# Altium schematic sheet nexus5.SchDoc
size A0
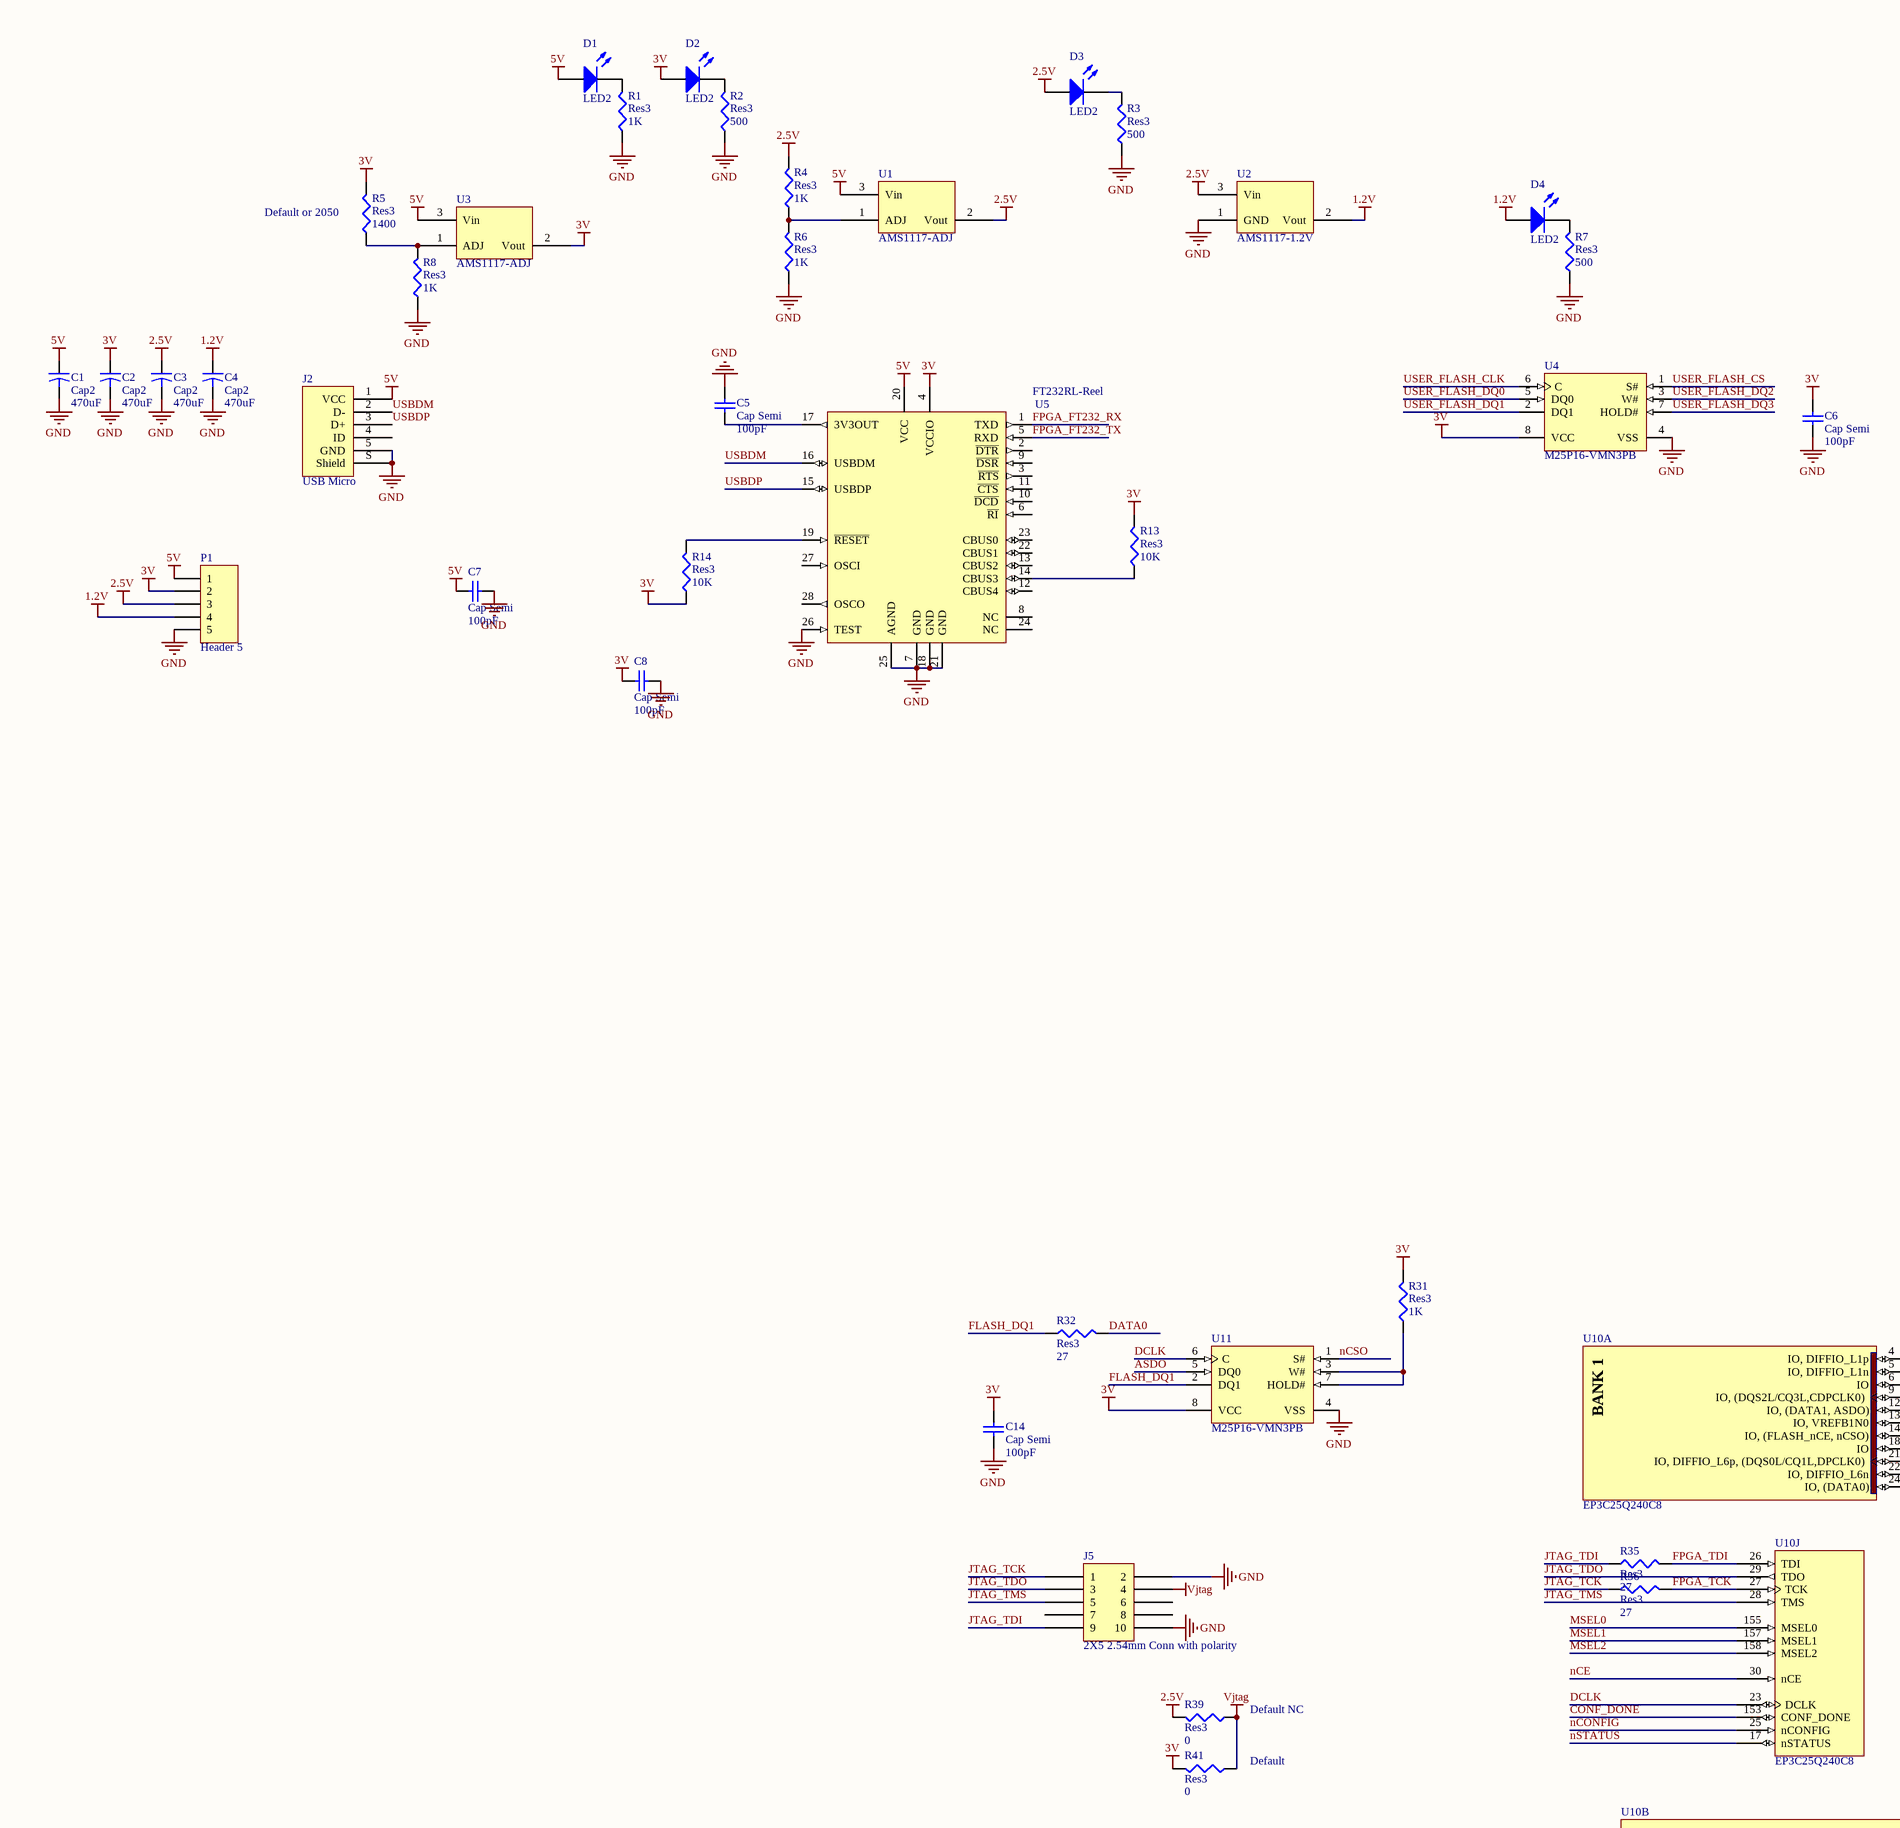
[diagram p0: nexus5.SchDoc, top left]
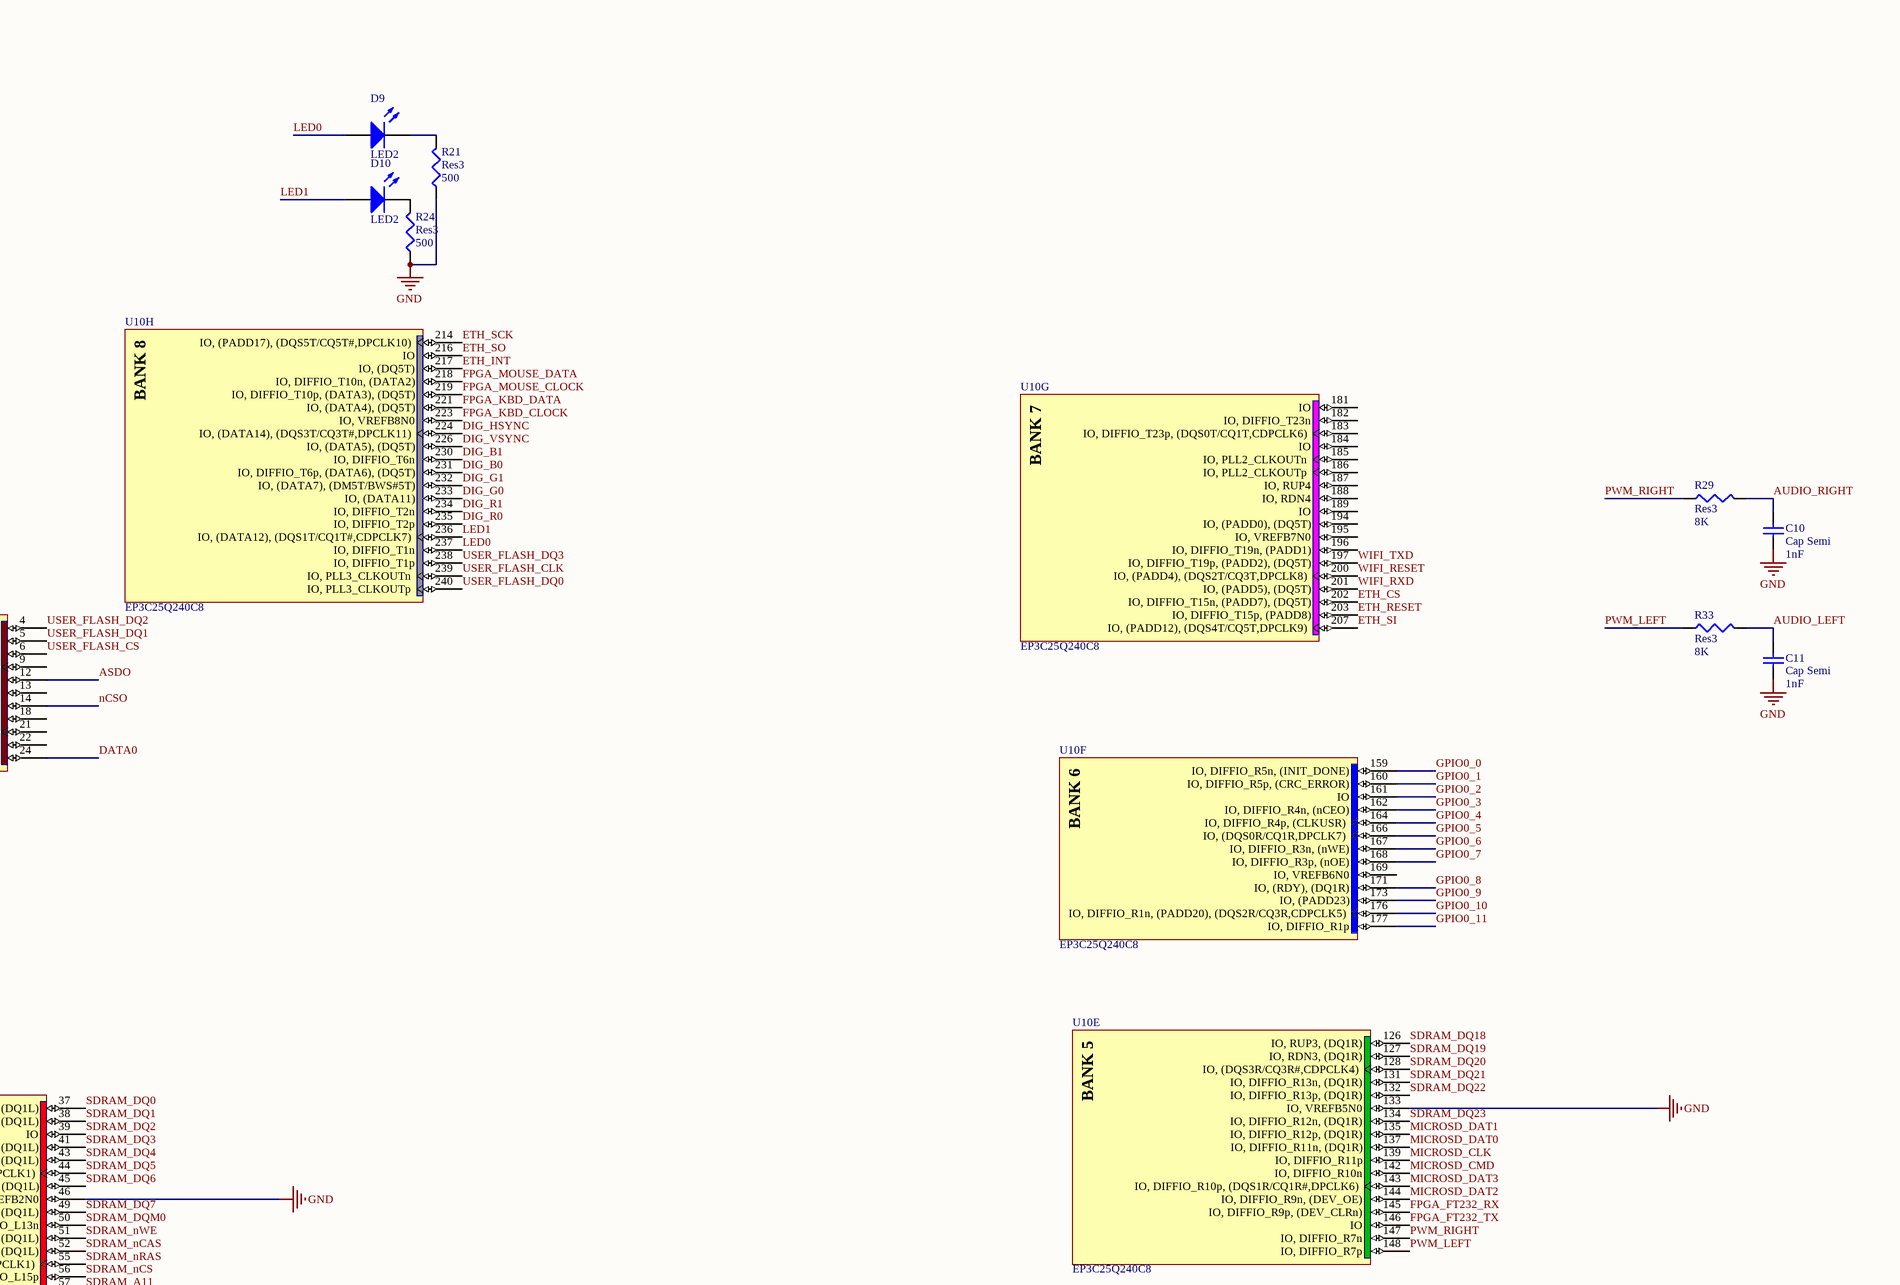
[diagram p1: nexus5.SchDoc, top middle]
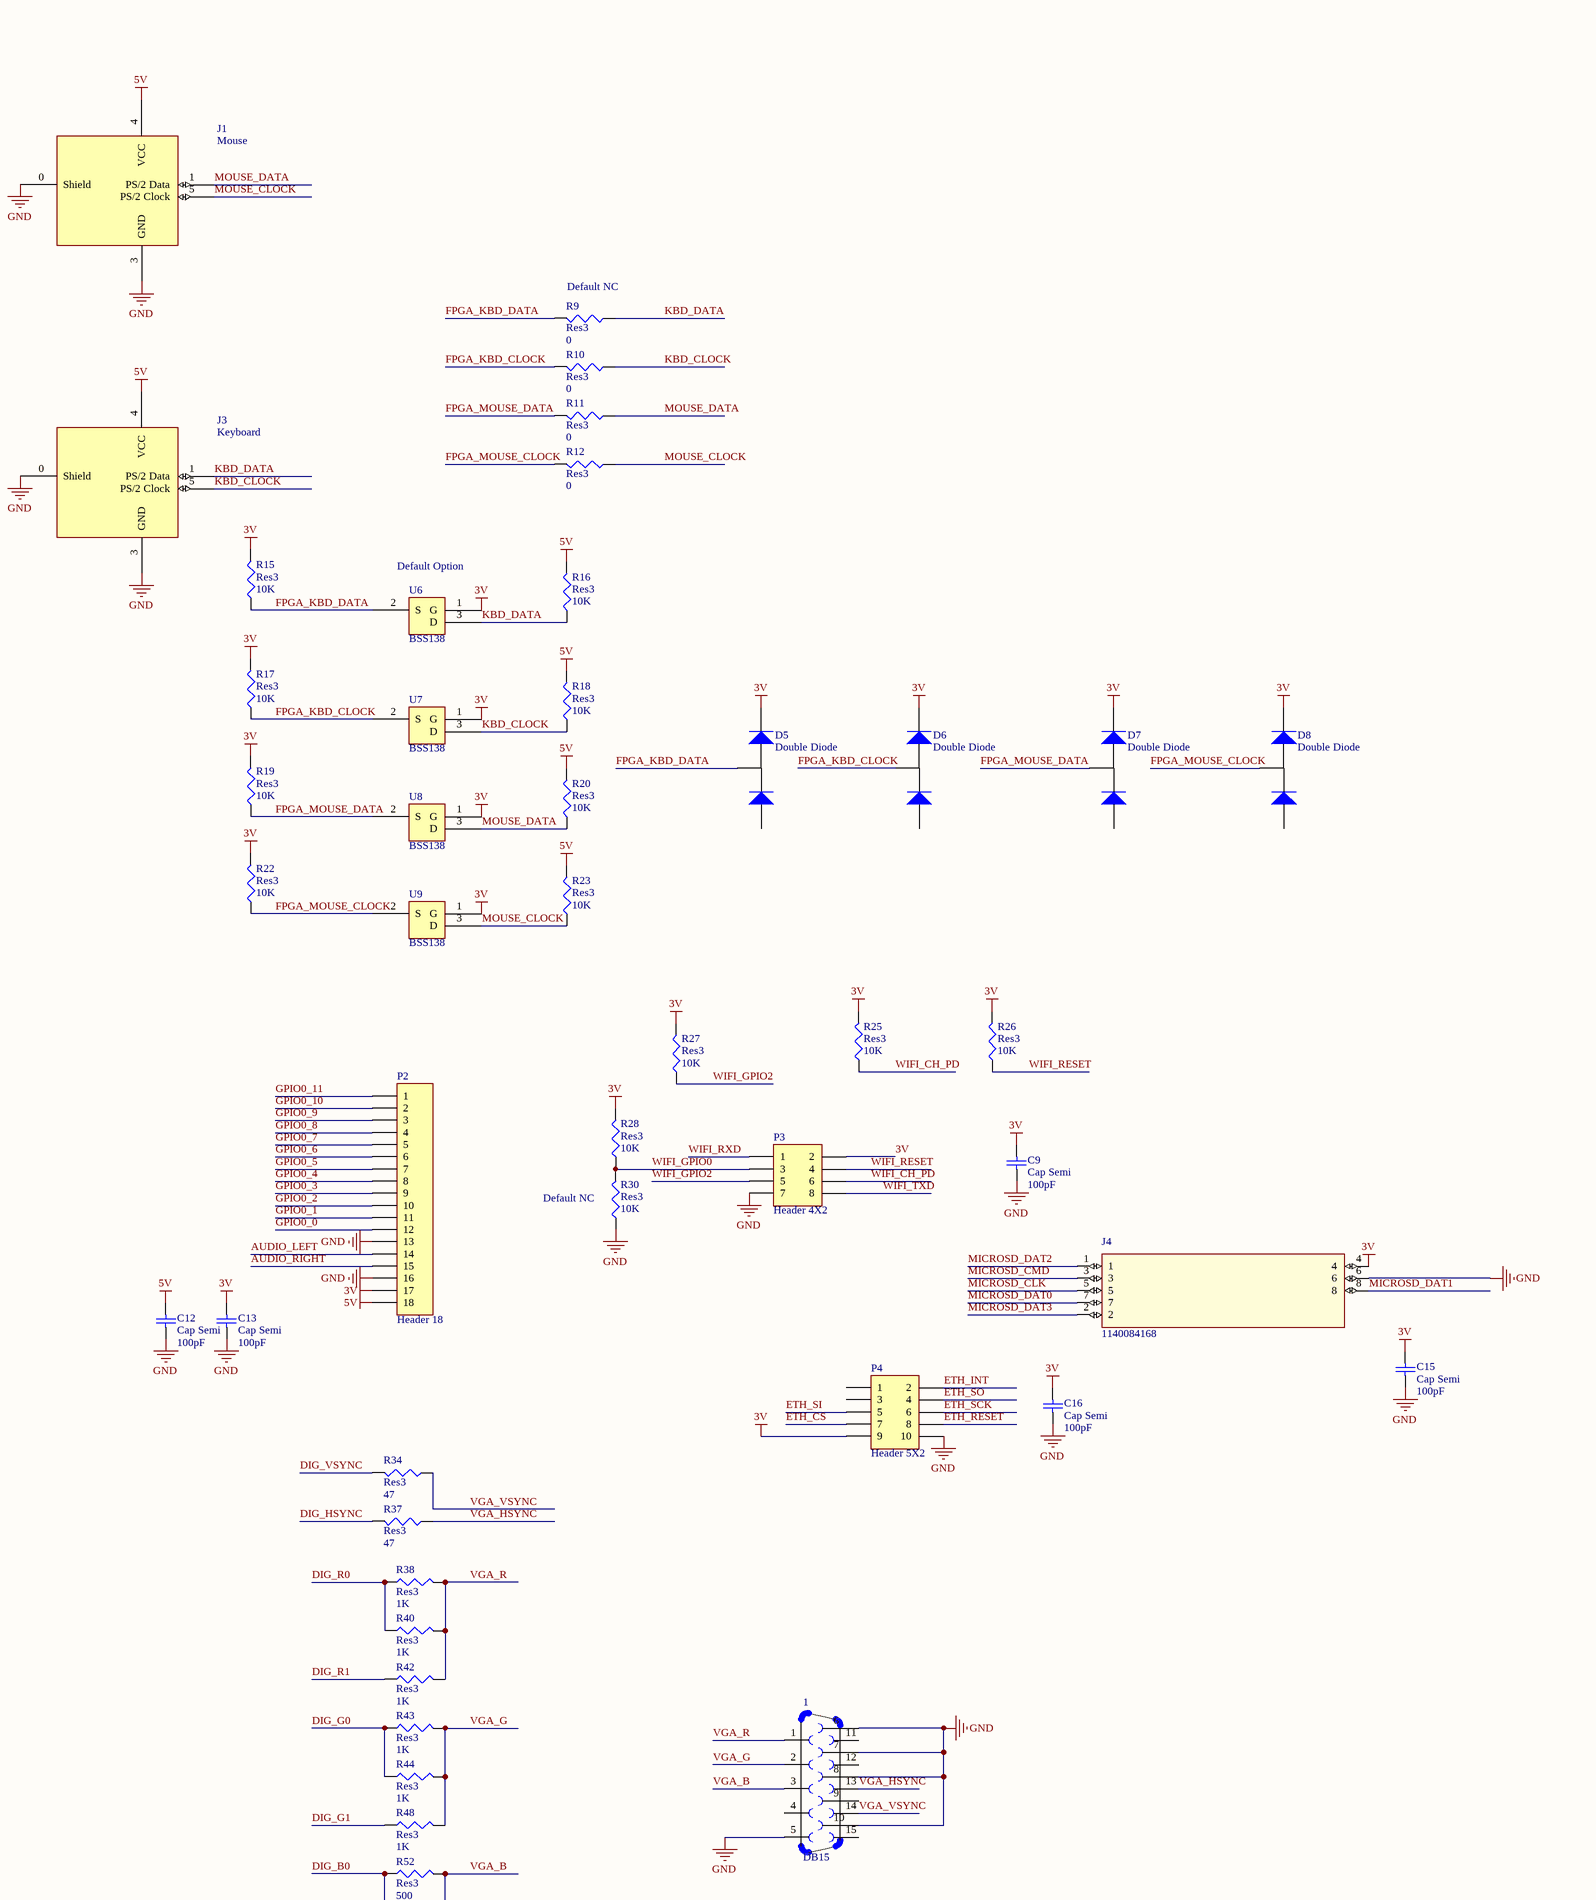
[diagram p2: nexus5.SchDoc, top right]
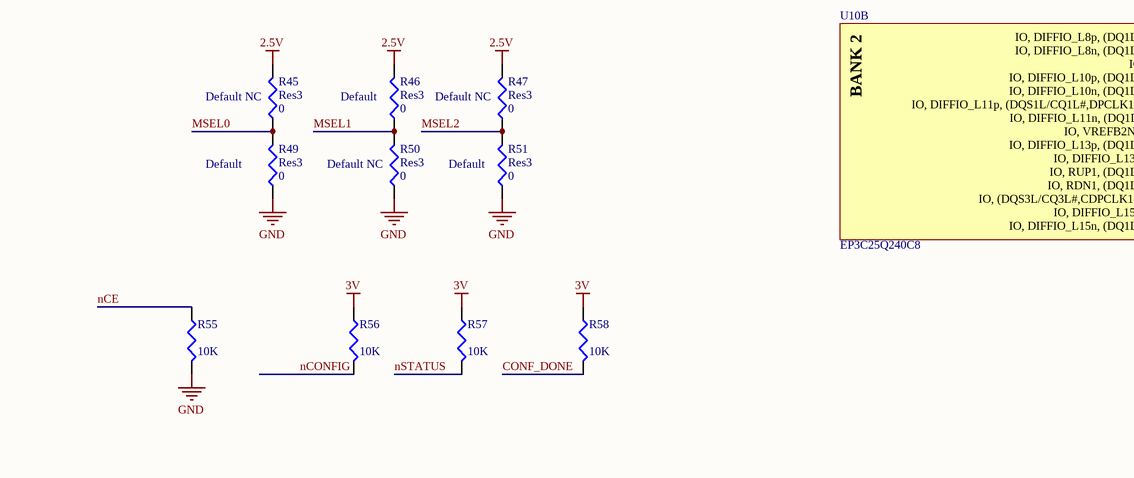
[diagram p3: nexus5.SchDoc, bottom left]
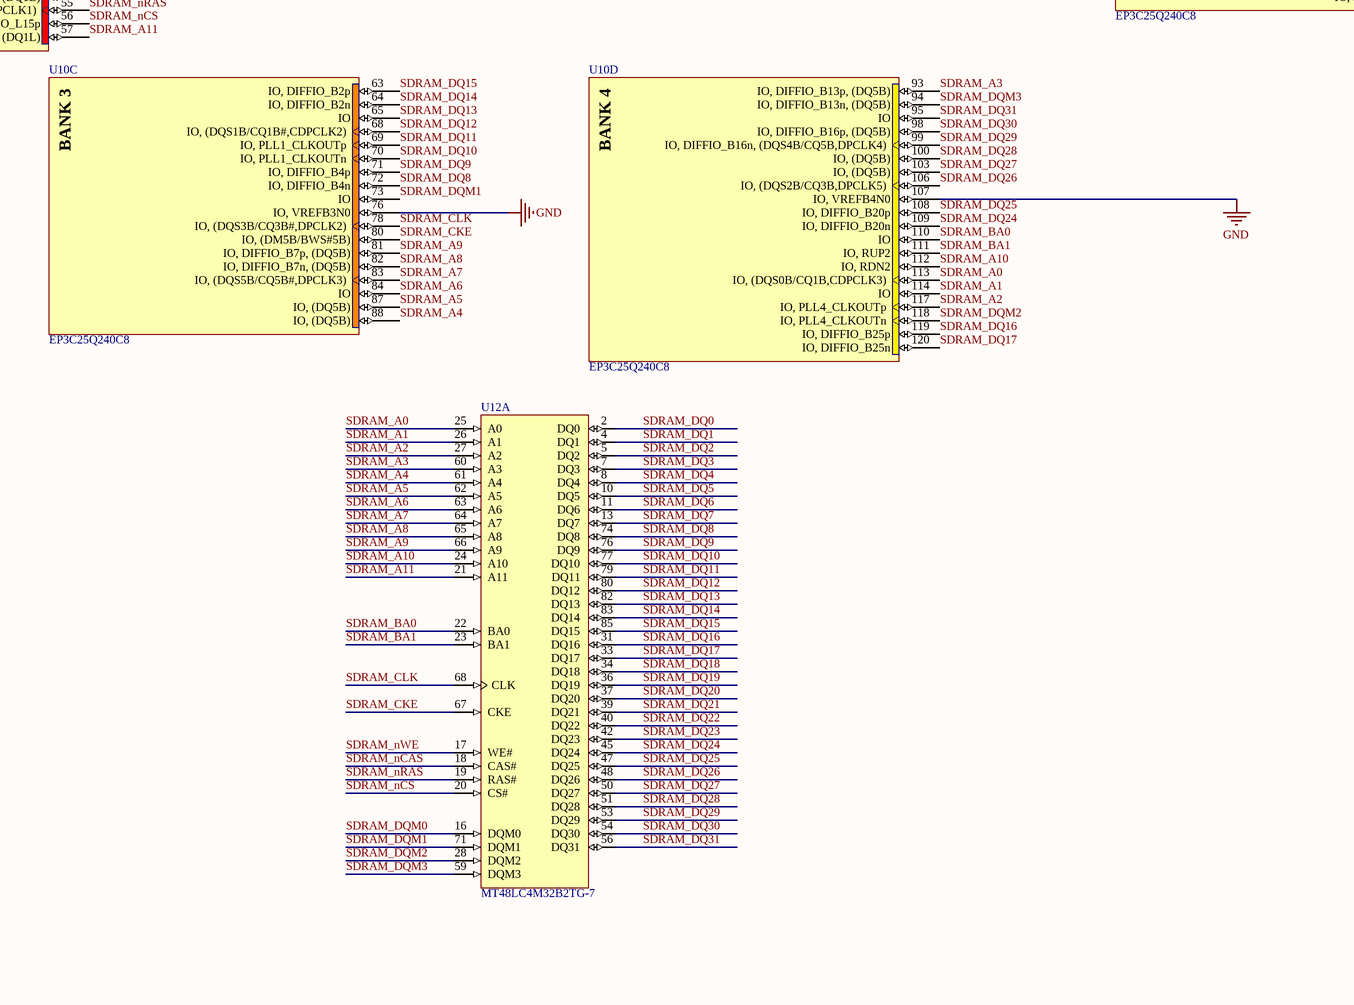
[diagram p4: nexus5.SchDoc, bottom middle]
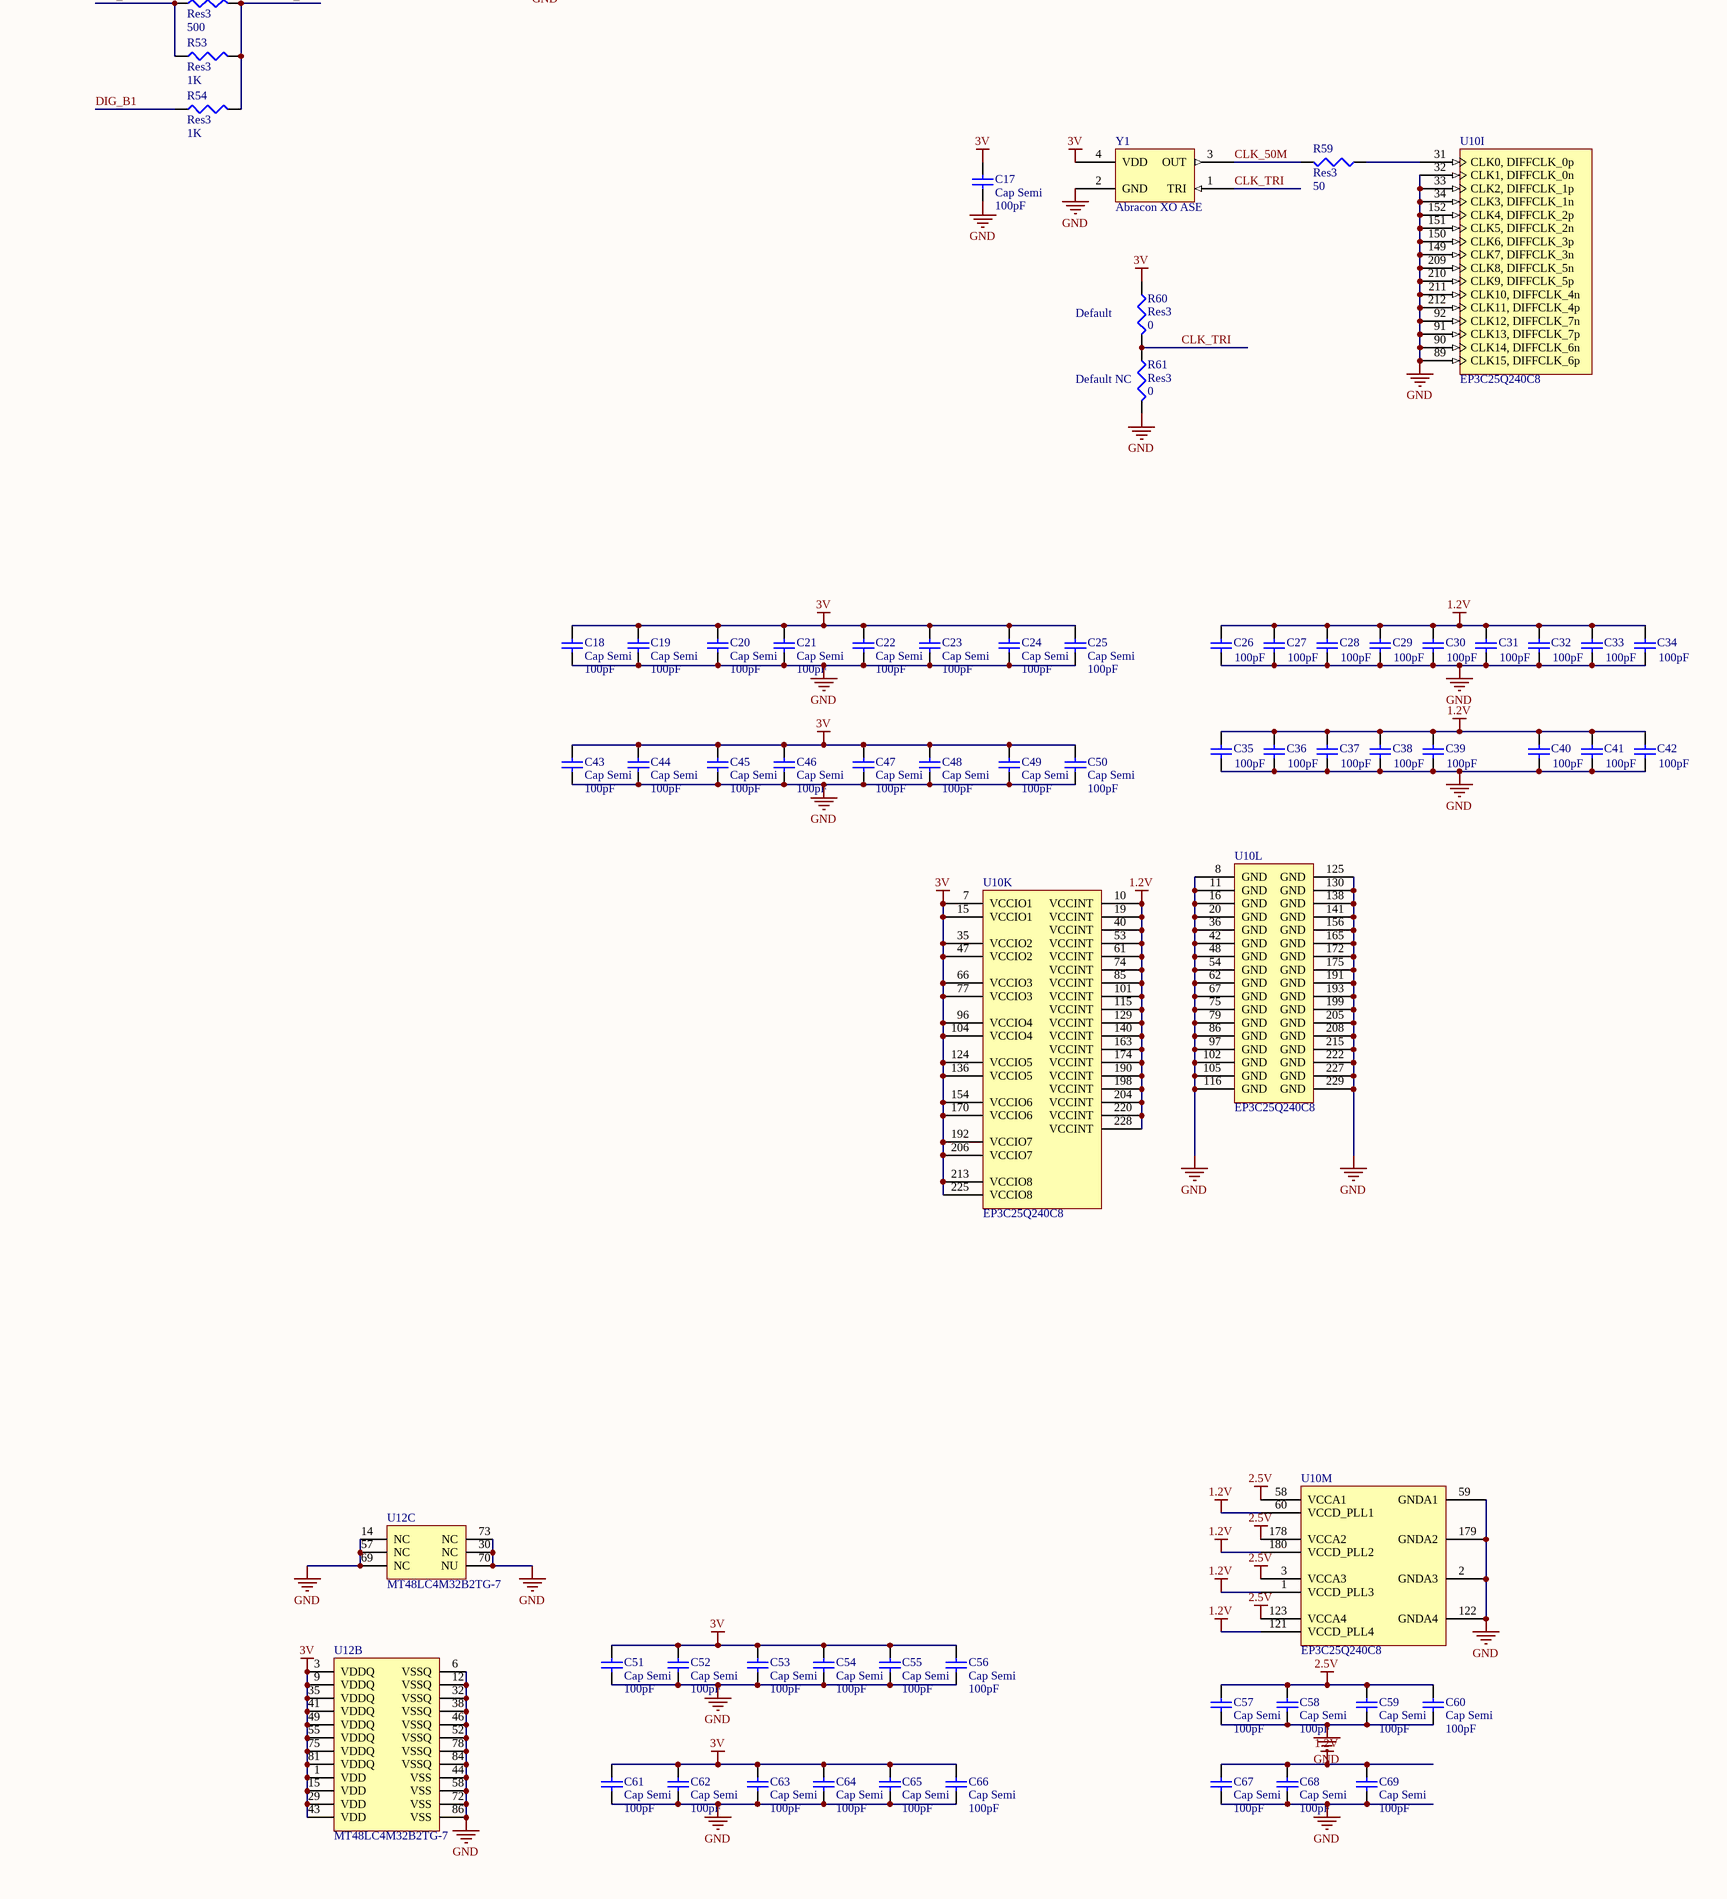
[diagram p5: nexus5.SchDoc, bottom right]

## Parts
1  DB15  [*DB15]
C1  Cap2  value 470uF  [Small Cap Pol]
C2  Cap2  value 470uF  [Small Cap Pol]
C3  Cap2  value 470uF  [Small Cap Pol]
C4  Cap2  value 470uF  [Small Cap Pol]
C5  Cap Semi  value 100pF  [1608[0603]]
C6  Cap Semi  value 100pF  [1608[0603]]
C7  Cap Semi  value 100pF  [1608[0603]]
C8  Cap Semi  value 100pF  [1608[0603]]
C9  Cap Semi  value 100pF  [1608[0603]]
C10  Cap Semi  value 1nF  [1608[0603]]
C11  Cap Semi  value 1nF  [1608[0603]]
C12  Cap Semi  value 100pF  [1608[0603]]
C13  Cap Semi  value 100pF  [1608[0603]]
C14  Cap Semi  value 100pF  [1608[0603]]
C15  Cap Semi  value 100pF  [1608[0603]]
C16  Cap Semi  value 100pF  [1608[0603]]
C17  Cap Semi  value 100pF  [1608[0603]]
C18  Cap Semi  value 100pF  [1608[0603]]
C19  Cap Semi  value 100pF  [1608[0603]]
C20  Cap Semi  value 100pF  [1608[0603]]
C21  Cap Semi  value 100pF  [1608[0603]]
C22  Cap Semi  value 100pF  [1608[0603]]
C23  Cap Semi  value 100pF  [1608[0603]]
C24  Cap Semi  value 100pF  [1608[0603]]
C25  Cap Semi  value 100pF  [1608[0603]]
C26  value 100pF  [1608[0603]]  (hidden comment: Cap Semi)
C27  value 100pF  [1608[0603]]  (hidden comment: Cap Semi)
C28  value 100pF  [1608[0603]]  (hidden comment: Cap Semi)
C29  value 100pF  [1608[0603]]  (hidden comment: Cap Semi)
C30  value 100pF  [1608[0603]]  (hidden comment: Cap Semi)
C31  value 100pF  [1608[0603]]  (hidden comment: Cap Semi)
C32  value 100pF  [1608[0603]]  (hidden comment: Cap Semi)
C33  value 100pF  [1608[0603]]  (hidden comment: Cap Semi)
C34  value 100pF  [1608[0603]]  (hidden comment: Cap Semi)
C35  value 100pF  [1608[0603]]  (hidden comment: Cap Semi)
C36  value 100pF  [1608[0603]]  (hidden comment: Cap Semi)
C37  value 100pF  [1608[0603]]  (hidden comment: Cap Semi)
C38  value 100pF  [1608[0603]]  (hidden comment: Cap Semi)
C39  value 100pF  [1608[0603]]  (hidden comment: Cap Semi)
C40  value 100pF  [1608[0603]]  (hidden comment: Cap Semi)
C41  value 100pF  [1608[0603]]  (hidden comment: Cap Semi)
C42  value 100pF  [1608[0603]]  (hidden comment: Cap Semi)
C43  Cap Semi  value 100pF  [1608[0603]]
C44  Cap Semi  value 100pF  [1608[0603]]
C45  Cap Semi  value 100pF  [1608[0603]]
C46  Cap Semi  value 100pF  [1608[0603]]
C47  Cap Semi  value 100pF  [1608[0603]]
C48  Cap Semi  value 100pF  [1608[0603]]
C49  Cap Semi  value 100pF  [1608[0603]]
C50  Cap Semi  value 100pF  [1608[0603]]
C51  Cap Semi  value 100pF  [1608[0603]]
C52  Cap Semi  value 100pF  [1608[0603]]
C53  Cap Semi  value 100pF  [1608[0603]]
C54  Cap Semi  value 100pF  [1608[0603]]
C55  Cap Semi  value 100pF  [1608[0603]]
C56  Cap Semi  value 100pF  [1608[0603]]
C57  Cap Semi  value 100pF  [1608[0603]]
C58  Cap Semi  value 100pF  [1608[0603]]
C59  Cap Semi  value 100pF  [1608[0603]]
C60  Cap Semi  value 100pF  [1608[0603]]
C61  Cap Semi  value 100pF  [1608[0603]]
C62  Cap Semi  value 100pF  [1608[0603]]
C63  Cap Semi  value 100pF  [1608[0603]]
C64  Cap Semi  value 100pF  [1608[0603]]
C65  Cap Semi  value 100pF  [1608[0603]]
C66  Cap Semi  value 100pF  [1608[0603]]
C67  Cap Semi  value 100pF  [1608[0603]]
C68  Cap Semi  value 100pF  [1608[0603]]
C69  Cap Semi  value 100pF  [1608[0603]]
D1  LED2  [3.2X1.6X1.1]
D2  LED2  [3.2X1.6X1.1]
D3  LED2  [3.2X1.6X1.1]
D4  LED2  [3.2X1.6X1.1]
D5  Double Diode  [SOT-23]
D6  Double Diode  [SOT-23]
D7  Double Diode  [SOT-23]
D8  Double Diode  [SOT-23]
D9  LED2  [3.2X1.6X1.1]
D10  LED2  [3.2X1.6X1.1]
J1  Mouse  [MD-60S]
J2  USB Micro  [FCI USB 10118193-0001LF]
J3  Keyboard  [MD-60S]
J4  1140084168  [1140084168]
J5  2X5 2.54mm Conn with polarity  [2X5 with polarity]
P1  Header 5  [HDR1X5]
P2  Header 18  [HDR1X18]
P3  Header 4X2  [HDR2X4]
P4  Header 5X2  [HDR2X5]
R1  Res3  value 1K  [J1-0603]
R2  Res3  value 500  [J1-0603]
R3  Res3  value 500  [J1-0603]
R4  Res3  value 1K  [J1-0603]
R5  Res3  value 1400  [J1-0603]
R6  Res3  value 1K  [J1-0603]
R7  Res3  value 500  [J1-0603]
R8  Res3  value 1K  [J1-0603]
R9  Res3  value 0  [J1-0603]
R10  Res3  value 0  [J1-0603]
R11  Res3  value 0  [J1-0603]
R12  Res3  value 0  [J1-0603]
R13  Res3  value 10K  [J1-0603]
R14  Res3  value 10K  [J1-0603]
R15  Res3  value 10K  [J1-0603]
R16  Res3  value 10K  [J1-0603]
R17  Res3  value 10K  [J1-0603]
R18  Res3  value 10K  [J1-0603]
R19  Res3  value 10K  [J1-0603]
R20  Res3  value 10K  [J1-0603]
R21  Res3  value 500  [J1-0603]
R22  Res3  value 10K  [J1-0603]
R23  Res3  value 10K  [J1-0603]
R24  Res3  value 500  [J1-0603]
R25  Res3  value 10K  [J1-0603]
R26  Res3  value 10K  [J1-0603]
R27  Res3  value 10K  [J1-0603]
R28  Res3  value 10K  [J1-0603]
R29  Res3  value 8K  [J1-0603]
R30  Res3  value 10K  [J1-0603]
R31  Res3  value 1K  [J1-0603]
R32  Res3  value 27  [J1-0603]
R33  Res3  value 8K  [J1-0603]
R34  Res3  value 47  [J1-0603]
R35  Res3  value 27  [J1-0603]
R36  Res3  value 27  [J1-0603]
R37  Res3  value 47  [J1-0603]
R38  Res3  value 1K  [J1-0603]
R39  Res3  value 0  [J1-0603]
R40  Res3  value 1K  [J1-0603]
R41  Res3  value 0  [J1-0603]
R42  Res3  value 1K  [J1-0603]
R43  Res3  value 1K  [J1-0603]
R44  Res3  value 1K  [J1-0603]
R45  Res3  value 0  [J1-0603]
R46  Res3  value 0  [J1-0603]
R47  Res3  value 0  [J1-0603]
R48  Res3  value 1K  [J1-0603]
R49  Res3  value 0  [J1-0603]
R50  Res3  value 0  [J1-0603]
R51  Res3  value 0  [J1-0603]
R52  Res3  value 500  [J1-0603]
R53  Res3  value 1K  [J1-0603]
R54  Res3  value 1K  [J1-0603]
R55  value 10K  [J1-0603]  (hidden comment: Res3)
R56  value 10K  [J1-0603]  (hidden comment: Res3)
R57  value 10K  [J1-0603]  (hidden comment: Res3)
R58  value 10K  [J1-0603]  (hidden comment: Res3)
R59  Res3  value 50  [J1-0603]
R60  Res3  value 0  [J1-0603]
R61  Res3  value 0  [J1-0603]
U1  AMS1117-ADJ  [SOT-223]
U2  AMS1117-1.2V  [SOT-223]
U3  AMS1117-ADJ  [SOT-223]
U4  M25P16-VMN3PB  [MICT-MN-8_N]
U5  FT232RL-Reel  [SSOP-28_N]
U6  BSS138  [SOT-23]
U7  BSS138  [SOT-23]
U8  BSS138  [SOT-23]
U9  BSS138  [SOT-23]
U10  EP3C25Q240C8  [PQFP240_N]  (parts A,B,C,D,E,F,G,H,I,J,K,L,M of 13)
U11  M25P16-VMN3PB  [MICT-MN-8_N]
U12  MT48LC4M32B2TG-7  [MICT-TG-86_N]  (parts A,B,C of 3)
Y1  Abracon XO ASE  [ABRACON ASE]

## Nets
1.2V: C4.1 C26.2 C27.2 C28.2 C29.2 C30.2 C31.2 C32.2 C33.2 C34.2 C35.2 C36.2 C37.2 C38.2 C39.2 C40.2 C41.2 C42.2 C67.2 C68.2 C69.2 D4.1(A) P1.4 U2.2(Vout) U10.1(VCCD_PLL3) U10.10(VCCINT) U10.19(VCCINT) U10.40(VCCINT) U10.53(VCCINT) U10.60(VCCD_PLL1) U10.61(VCCINT) U10.74(VCCINT) U10.85(VCCINT) U10.101(VCCINT) U10.115(VCCINT) U10.121(VCCD_PLL4) U10.129(VCCINT) U10.140(VCCINT) U10.163(VCCINT) U10.174(VCCINT) U10.180(VCCD_PLL2) U10.190(VCCINT) U10.198(VCCINT) U10.204(VCCINT) U10.220(VCCINT) U10.228(VCCINT)
2.5V: C3.1 C57.2 C58.2 C59.2 C60.2 D3.1(A) P1.3 R4.2 R39.2 R45.2 R46.2 R47.2 U1.2(Vout) U2.3(Vin) U10.3(VCCA3) U10.58(VCCA1) U10.123(VCCA4) U10.178(VCCA2)
3V: C2.1 C6.2 C8.1 C9.2 C13.2 C14.2 C15.2 C16.2 C17.2 C18.2 C19.2 C20.2 C21.2 C22.2 C23.2 C24.2 C25.2 C43.2 C44.2 C45.2 C46.2 C47.2 C48.2 C49.2 C50.2 C51.2 C52.2 C53.2 C54.2 C55.2 C56.2 C61.2 C62.2 C63.2 C64.2 C65.2 C66.2 D2.1(A) D5.2 D6.2 D7.2 D8.2 J4.4 P1.2 P2.17 P3.2 P4.9 R5.2 R13.2 R14.1 R15.2 R17.2 R19.2 R22.2 R25.2 R26.2 R27.2 R28.2 R31.2 R41.2 R56.1 R57.1 R58.1 R60.1 U3.2(Vout) U4.8(VCC) U5.4(VCCIO) U6.1(G) U7.1(G) U8.1(G) U9.1(G) U10.7(VCCIO1) U10.15(VCCIO1) U10.35(VCCIO2) U10.47(VCCIO2) U10.66(VCCIO3) U10.77(VCCIO3) U10.96(VCCIO4) U10.104(VCCIO4) U10.124(VCCIO5) U10.136(VCCIO5) U10.154(VCCIO6) U10.170(VCCIO6) U10.192(VCCIO7) U10.206(VCCIO7) U10.213(VCCIO8) U10.225(VCCIO8) U11.8(VCC) U12.1(VDD) U12.3(VDDQ) U12.9(VDDQ) U12.15(VDD) U12.29(VDD) U12.35(VDDQ) U12.41(VDDQ) U12.43(VDD) U12.49(VDDQ) U12.55(VDDQ) U12.75(VDDQ) U12.81(VDDQ) Y1.4(VDD)
5V: C1.1 C7.1 C12.2 D1.1(A) J1.4(VCC) J2.1(VCC) J3.4(VCC) P1.1 P2.18 R16.2 R18.2 R20.2 R23.2 U1.3(Vin) U3.3(Vin) U5.20(VCC)
GND: 1.5 1.6 1.7 1.8 1.10 C1.2 C2.2 C3.2 C4.2 C5.2 C6.1 C7.2 C8.2 C9.1 C10.1 C11.1 C12.1 C13.1 C14.1 C15.1 C16.1 C17.1 C18.1 C19.1 C20.1 C21.1 C22.1 C23.1 C24.1 C25.1 C26.1 C27.1 C28.1 C29.1 C30.1 C31.1 C32.1 C33.1 C34.1 C35.1 C36.1 C37.1 C38.1 C39.1 C40.1 C41.1 C42.1 C43.1 C44.1 C45.1 C46.1 C47.1 C48.1 C49.1 C50.1 C51.1 C52.1 C53.1 C54.1 C55.1 C56.1 C57.1 C58.1 C59.1 C60.1 C61.1 C62.1 C63.1 C64.1 C65.1 C66.1 C67.1 C68.1 C69.1 J1.0(Shield) J1.3(GND) J2.5(GND) J2.S(Shield) J3.0(Shield) J3.3(GND) J4.6 J5.2 J5.10 P1.5 P2.13 P2.16 P3.7 P4.10 R1.1 R2.1 R3.1 R6.1 R7.1 R8.1 R21.1 R24.1 R30.1 R49.1 R50.1 R51.1 R55.2 R61.2 U2.1(GND) U4.4(VSS) U5.7(GND) U5.18(GND) U5.21(GND) U5.25(AGND) U5.26(TEST) U10.2(GNDA3) U10.8(GND) U10.11(GND) U10.16(GND) U10.20(GND) U10.32(CLK1,_DIFFCLK_0n) U10.33(CLK2,_DIFFCLK_1p) U10.34(CLK3,_DIFFCLK_1n) U10.36(GND) U10.42(GND) U10.46(IO,_VREFB2N0) U10.48(GND) U10.54(GND) U10.59(GNDA1) U10.62(GND) U10.67(GND) U10.75(GND) U10.76(IO,_VREFB3N0) U10.79(GND) U10.86(GND) U10.89(CLK15,_DIFFCLK_6p) U10.90(CLK14,_DIFFCLK_6n) U10.91(CLK13,_DIFFCLK_7p) U10.92(CLK12,_DIFFCLK_7n) U10.97(GND) U10.102(GND) U10.105(GND) U10.107(IO,_VREFB4N0) U10.116(GND) U10.122(GNDA4) U10.125(GND) U10.130(GND) U10.133(IO,_VREFB5N0) U10.138(GND) U10.141(GND) U10.149(CLK7,_DIFFCLK_3n) U10.150(CLK6,_DIFFCLK_3p) U10.151(CLK5,_DIFFCLK_2n) U10.152(CLK4,_DIFFCLK_2p) U10.156(GND) U10.165(GND) U10.172(GND) U10.175(GND) U10.179(GNDA2) U10.191(GND) U10.193(GND) U10.199(GND) U10.205(GND) U10.208(GND) U10.209(CLK8,_DIFFCLK_5n) U10.210(CLK9,_DIFFCLK_5p) U10.211(CLK10,_DIFFCLK_4n) U10.212(CLK11,_DIFFCLK_4p) U10.215(GND) U10.222(GND) U10.227(GND) U10.229(GND) U11.4(VSS) U12.6(VSSQ) U12.12(VSSQ) U12.14(NC) U12.30(NC) U12.32(VSSQ) U12.38(VSSQ) U12.44(VSS) U12.46(VSSQ) U12.52(VSSQ) U12.57(NC) U12.58(VSS) U12.69(NC) U12.70(NU) U12.72(VSS) U12.73(NC) U12.78(VSSQ) U12.84(VSSQ) U12.86(VSS) Y1.2(GND)
Vjtag: J5.4 R39.1 R41.1
ASDO: U10.12(IO,_(DATA1,_ASDO)) U11.5(DQ0)
AUDIO_LEFT: C11.2 P2.14 R33.2
AUDIO_RIGHT: C10.2 P2.15 R29.2
CLK_50M: R59.2 Y1.3(OUT)
CLK_TRI: R60.2 R61.1 Y1.1(TRI)
CONF_DONE: R58.2 U10.153(CONF_DONE)
DATA0: R32.2 U10.24(IO,_(DATA0))
DCLK: U10.23(DCLK) U11.6(C)
DIG_B0: R52.1 R53.1 U10.231(IO,_DIFFIO_T6p,_(DATA6),_(DQ5T))
DIG_B1: R54.1 U10.230(IO,_DIFFIO_T6n)
DIG_G0: R43.1 R44.1 U10.233(IO,_(DATA11))
DIG_G1: R48.1 U10.232(IO,_(DATA7),_(DM5T/BWS#5T))
DIG_HSYNC: R37.2 U10.224(IO,_(DATA14),_(DQS3T/CQ3T#,DPCLK11))
DIG_R0: R38.1 R40.1 U10.235(IO,_DIFFIO_T2p)
DIG_R1: R42.1 U10.234(IO,_DIFFIO_T2n)
DIG_VSYNC: R34.2 U10.226(IO,_(DATA5),_(DQ5T))
ETH_CS: P4.7 U10.202(IO,_DIFFIO_T15n,_(PADD7),_(DQ5T))
ETH_INT: P4.2 U10.217(IO,_(DQ5T))
ETH_RESET: P4.8 U10.203(IO,_DIFFIO_T15p,_(PADD8))
ETH_SCK: P4.6 U10.214(IO,_(PADD17),_(DQS5T/CQ5T#,DPCLK10))
ETH_SI: P4.5 U10.207(IO,_(PADD12),_(DQS4T/CQ5T,DPCLK9))
ETH_SO: P4.4 U10.216(IO)
FLASH_DQ1: R32.1 U11.2(DQ1)
FPGA_FT232_RX: U5.1(TXD) U10.145(IO,_DIFFIO_R9p,_(DEV_CLRn))
FPGA_FT232_TX: U5.5(RXD) U10.146(IO)
FPGA_KBD_CLOCK: D6.3 R10.2 R17.1 U7.2(S) U10.223(IO,_VREFB8N0)
FPGA_KBD_DATA: D5.3 R9.2 R15.1 U6.2(S) U10.221(IO,_(DATA4),_(DQ5T))
FPGA_MOUSE_CLOCK: D8.3 R12.2 R22.1 U9.2(S) U10.219(IO,_DIFFIO_T10p,_(DATA3),_(DQ5T))
FPGA_MOUSE_DATA: D7.3 R11.2 R19.1 U8.2(S) U10.218(IO,_DIFFIO_T10n,_(DATA2))
FPGA_TCK: R36.2 U10.27(TCK)
FPGA_TDI: R35.2 U10.26(TDI)
GPIO0_0: P2.12 U10.159(IO,_DIFFIO_R5n,_(INIT_DONE))
GPIO0_1: P2.11 U10.160(IO,_DIFFIO_R5p,_(CRC_ERROR))
GPIO0_2: P2.10 U10.161(IO)
GPIO0_3: P2.9 U10.162(IO,_DIFFIO_R4n,_(nCEO))
GPIO0_4: P2.8 U10.164(IO,_DIFFIO_R4p,_(CLKUSR))
GPIO0_5: P2.7 U10.166(IO,_(DQS0R/CQ1R,DPCLK7))
GPIO0_6: P2.6 U10.167(IO,_DIFFIO_R3n,_(nWE))
GPIO0_7: P2.5 U10.168(IO,_DIFFIO_R3p,_(nOE))
GPIO0_8: P2.4 U10.171(IO,_(RDY),_(DQ1R))
GPIO0_9: P2.3 U10.173(IO,_(PADD23))
GPIO0_10: P2.2 U10.176(IO,_DIFFIO_R1n,_(PADD20),_(DQS2R/CQ3R,CDPCLK5))
GPIO0_11: P2.1 U10.177(IO,_DIFFIO_R1p)
JTAG_TCK: J5.1 R36.1
JTAG_TDI: J5.9 R35.1
JTAG_TDO: J5.3 U10.29(TDO)
JTAG_TMS: J5.5 U10.28(TMS)
KBD_CLOCK: J3.5(PS/2_Clock) R10.1 R18.1 U7.3(D)
KBD_DATA: J3.1(PS/2_Data) R9.1 R16.1 U6.3(D)
LED0: D9.1(A) U10.237(IO,_DIFFIO_T1n)
LED1: D10.1(A) U10.236(IO,_(DATA12),_(DQS1T/CQ1T#,CDPCLK7))
MICROSD_CLK: J4.5 U10.139(IO,_DIFFIO_R11p)
MICROSD_CMD: J4.3 U10.142(IO,_DIFFIO_R10n)
MICROSD_DAT0: J4.7 U10.137(IO,_DIFFIO_R11n,_(DQ1R))
MICROSD_DAT1: J4.8 U10.135(IO,_DIFFIO_R12p,_(DQ1R))
MICROSD_DAT2: J4.1 U10.144(IO,_DIFFIO_R9n,_(DEV_OE))
MICROSD_DAT3: J4.2 U10.143(IO,_DIFFIO_R10p,_(DQS1R/CQ1R#,DPCLK6))
MOUSE_CLOCK: J1.5(PS/2_Clock) R12.1 R23.1 U9.3(D)
MOUSE_DATA: J1.1(PS/2_Data) R11.1 R20.1 U8.3(D)
MSEL0: R45.1 R49.2 U10.155(MSEL0)
MSEL1: R46.1 R50.2 U10.157(MSEL1)
MSEL2: R47.1 R51.2 U10.158(MSEL2)
nCE: R55.1 U10.30(nCE)
nCONFIG: R56.2 U10.25(nCONFIG)
nCSO: U10.14(IO,_(FLASH_nCE,_nCSO)) U11.1(S#)
nSTATUS: R57.2 U10.17(nSTATUS)
PWM_LEFT: R33.1 U10.148(IO,_DIFFIO_R7p)
PWM_RIGHT: R29.1 U10.147(IO,_DIFFIO_R7n)
SDRAM_A0: U10.113(IO,_(DQS0B/CQ1B,CDPCLK3)) U12.25(A0)
SDRAM_A1: U10.114(IO) U12.26(A1)
SDRAM_A2: U10.117(IO,_PLL4_CLKOUTp) U12.27(A2)
SDRAM_A3: U10.93(IO,_DIFFIO_B13p,_(DQ5B)) U12.60(A3)
SDRAM_A4: U10.88(IO,_(DQ5B)) U12.61(A4)
SDRAM_A5: U10.87(IO,_(DQ5B)) U12.62(A5)
SDRAM_A6: U10.84(IO) U12.63(A6)
SDRAM_A7: U10.83(IO,_(DQS5B/CQ5B#,DPCLK3)) U12.64(A7)
SDRAM_A8: U10.82(IO,_DIFFIO_B7n,_(DQ5B)) U12.65(A8)
SDRAM_A9: U10.81(IO,_DIFFIO_B7p,_(DQ5B)) U12.66(A9)
SDRAM_A10: U10.112(IO,_RDN2) U12.24(A10)
SDRAM_A11: U10.57(IO,_DIFFIO_L15n,_(DQ1L)) U12.21(A11)
SDRAM_BA0: U10.110(IO) U12.22(BA0)
SDRAM_BA1: U10.111(IO,_RUP2) U12.23(BA1)
SDRAM_CKE: U10.80(IO,_(DM5B/BWS#5B)) U12.67(CKE)
SDRAM_CLK: U10.78(IO,_(DQS3B/CQ3B#,DPCLK2)) U12.68(CLK)
SDRAM_DQ0: U10.37(IO,_DIFFIO_L8p,_(DQ1L)) U12.2(DQ0)
SDRAM_DQ1: U10.38(IO,_DIFFIO_L8n,_(DQ1L)) U12.4(DQ1)
SDRAM_DQ2: U10.39(IO) U12.5(DQ2)
SDRAM_DQ3: U10.41(IO,_DIFFIO_L10p,_(DQ1L)) U12.7(DQ3)
SDRAM_DQ4: U10.43(IO,_DIFFIO_L10n,_(DQ1L)) U12.8(DQ4)
SDRAM_DQ5: U10.44(IO,_DIFFIO_L11p,_(DQS1L/CQ1L#,DPCLK1)) U12.10(DQ5)
SDRAM_DQ6: U10.45(IO,_DIFFIO_L11n,_(DQ1L)) U12.11(DQ6)
SDRAM_DQ7: U10.49(IO,_DIFFIO_L13p,_(DQ1L)) U12.13(DQ7)
SDRAM_DQ8: U10.72(IO,_DIFFIO_B4n) U12.74(DQ8)
SDRAM_DQ9: U10.71(IO,_DIFFIO_B4p) U12.76(DQ9)
SDRAM_DQ10: U10.70(IO,_PLL1_CLKOUTn) U12.77(DQ10)
SDRAM_DQ11: U10.69(IO,_PLL1_CLKOUTp) U12.79(DQ11)
SDRAM_DQ12: U10.68(IO,_(DQS1B/CQ1B#,CDPCLK2)) U12.80(DQ12)
SDRAM_DQ13: U10.65(IO) U12.82(DQ13)
SDRAM_DQ14: U10.64(IO,_DIFFIO_B2n) U12.83(DQ14)
SDRAM_DQ15: U10.63(IO,_DIFFIO_B2p) U12.85(DQ15)
SDRAM_DQ16: U10.119(IO,_DIFFIO_B25p) U12.31(DQ16)
SDRAM_DQ17: U10.120(IO,_DIFFIO_B25n) U12.33(DQ17)
SDRAM_DQ18: U10.126(IO,_RUP3,_(DQ1R)) U12.34(DQ18)
SDRAM_DQ19: U10.127(IO,_RDN3,_(DQ1R)) U12.36(DQ19)
SDRAM_DQ20: U10.128(IO,_(DQS3R/CQ3R#,CDPCLK4)) U12.37(DQ20)
SDRAM_DQ21: U10.131(IO,_DIFFIO_R13n,_(DQ1R)) U12.39(DQ21)
SDRAM_DQ22: U10.132(IO,_DIFFIO_R13p,_(DQ1R)) U12.40(DQ22)
SDRAM_DQ23: U10.134(IO,_DIFFIO_R12n,_(DQ1R)) U12.42(DQ23)
SDRAM_DQ24: U10.109(IO,_DIFFIO_B20n) U12.45(DQ24)
SDRAM_DQ25: U10.108(IO,_DIFFIO_B20p) U12.47(DQ25)
SDRAM_DQ26: U10.106(IO,_(DQS2B/CQ3B,DPCLK5)) U12.48(DQ26)
SDRAM_DQ27: U10.103(IO,_(DQ5B)) U12.50(DQ27)
SDRAM_DQ28: U10.100(IO,_(DQ5B)) U12.51(DQ28)
SDRAM_DQ29: U10.99(IO,_DIFFIO_B16n,_(DQS4B/CQ5B,DPCLK4)) U12.53(DQ29)
SDRAM_DQ30: U10.98(IO,_DIFFIO_B16p,_(DQ5B)) U12.54(DQ30)
SDRAM_DQ31: U10.95(IO) U12.56(DQ31)
SDRAM_DQM0: U10.50(IO,_DIFFIO_L13n) U12.16(DQM0)
SDRAM_DQM1: U10.73(IO) U12.71(DQM1)
SDRAM_DQM2: U10.118(IO,_PLL4_CLKOUTn) U12.28(DQM2)
SDRAM_DQM3: U10.94(IO,_DIFFIO_B13n,_(DQ5B)) U12.59(DQM3)
SDRAM_nCAS: U10.52(IO,_RDN1,_(DQ1L)) U12.18(CAS#)
SDRAM_nCS: U10.56(IO,_DIFFIO_L15p) U12.20(CS#)
SDRAM_nRAS: U10.55(IO,_(DQS3L/CQ3L#,CDPCLK1)) U12.19(RAS#)
SDRAM_nWE: U10.51(IO,_RUP1,_(DQ1L)) U12.17(WE#)
USBDM: J2.2(D-) U5.16(USBDM)
USBDP: J2.3(D+) U5.15(USBDP)
USER_FLASH_CLK: U4.6(C) U10.239(IO,_PLL3_CLKOUTn)
USER_FLASH_CS: U4.1(S#) U10.6(IO)
USER_FLASH_DQ0: U4.5(DQ0) U10.240(IO,_PLL3_CLKOUTp)
USER_FLASH_DQ1: U4.2(DQ1) U10.5(IO,_DIFFIO_L1n)
USER_FLASH_DQ2: U4.3(W#) U10.4(IO,_DIFFIO_L1p)
USER_FLASH_DQ3: U4.7(HOLD#) U10.238(IO,_DIFFIO_T1p)
VGA_B: 1.3 R52.2 R53.2 R54.2
VGA_G: 1.2 R43.2 R44.2 R48.2
VGA_HSYNC: 1.13 R37.1
VGA_R: 1.1 R38.2 R40.2 R42.2
VGA_VSYNC: 1.14 R34.1
WIFI_CH_PD: P3.6 R25.1
WIFI_GPIO0: P3.3 R28.1 R30.2
WIFI_GPIO2: P3.5 R27.1
WIFI_RESET: P3.4 R26.1 U10.200(IO,_(PADD4),_(DQS2T/CQ3T,DPCLK8))
WIFI_RXD: P3.1 U10.201(IO,_(PADD5),_(DQ5T))
WIFI_TXD: P3.8 U10.197(IO,_DIFFIO_T19p,_(PADD2),_(DQ5T))
NetC5_1: C5.1 U5.17(3V3OUT)
NetD1_2: D1.2(K) R1.2
NetD2_2: D2.2(K) R2.2
NetD3_2: D3.2(K) R3.2
NetD4_2: D4.2(K) R7.2
NetD9_2: D9.2(K) R21.2
NetD10_2: D10.2(K) R24.2
NetR4_1: R4.1 R6.2 U1.1(ADJ)
NetR5_1: R5.1 R8.2 U3.1(ADJ)
NetR13_1: R13.1 U5.14(CBUS3)
NetR14_2: R14.2 U5.19(~{RESET})
NetR31_1: R31.1 U11.3(W#) U11.7(HOLD#)
NetR59_1: R59.1 U10.31(CLK0,_DIFFCLK_0p)

Not connected (* = marked no-connect by the designer): 1 4 9 11 12 15; D5 1; D6 1; D7 1; D8 1; J2 4(ID); J5 6 7 8; P4 1 3; U5 2(~{DTR}) 3(~{RTS}) 6(~{RI}) 8(NC) 9(~{DSR}) 10(~{DCD}) 11(~{CTS}) 12(CBUS4) 13(CBUS2) 22(CBUS1) 23(CBUS0) 24(NC) 27(OSCI) 28(OSCO); U10 9(IO,_(DQS2L/CQ3L,CDPCLK0)) 13(IO,_VREFB1N0) 18(IO) 21(IO,_DIFFIO_L6p,_(DQS0L/CQ1L,DPCLK0)) 22(IO,_DIFFIO_L6n) 169(IO,_VREFB6N0) 181(IO) 182(IO,_DIFFIO_T23n) 183(IO,_DIFFIO_T23p,_(DQS0T/CQ1T,CDPCLK6)) 184(IO) 185(IO,_PLL2_CLKOUTn) 186(IO,_PLL2_CLKOUTp) 187(IO,_RUP4) 188(IO,_RDN4) 189(IO) 194(IO,_(PADD0),_(DQ5T)) 195(IO,_VREFB7N0) 196(IO,_DIFFIO_T19n,_(PADD1))

## Notes on the sheet
- (near R5) Default or 2050
- (near R9) Default NC
- (near U6) Default Option
- (near R30) Default NC
- (near R39) Default NC
- (near R41) Default
- (near R45) Default NC
- (near R46) Default
- (near R47) Default NC
- (near R49) Default
- (near R50) Default NC
- (near R51) Default
- (near R60) Default
- (near R61) Default NC
- (in symbol EP3C25Q240C8, part A) BANK 1
- (in symbol EP3C25Q240C8, part B) BANK 2
- (in symbol EP3C25Q240C8, part C) BANK 3
- (in symbol EP3C25Q240C8, part D) BANK 4
- (in symbol EP3C25Q240C8, part E) BANK 5
- (in symbol EP3C25Q240C8, part F) BANK 6
- (in symbol EP3C25Q240C8, part G) BANK 7
- (in symbol EP3C25Q240C8, part H) BANK 8

## Library data of the parts
1 = DB15: Conn, f, 15rgb, 1 Piece; MF: Belden Inc.; SnapEDA_Link: https://www.snapeda.com/parts/DB15/Belden%20Inc./view-part/?ref=snap; Price: None; Availability: Unavailable; Package: None; MP: DB15; Value: *
C1-C4 = Cap2: Capacitor; Published: 23-Sep-2002; PackageReference: CAPR5-4X5; Publisher: Altium Limited; PackageDescription: Capacitor; 2 Leads
C5-C69 = Cap Semi: Capacitor (Semiconductor SIM Model); Published: 8-Jun-2000; LatestRevisionDate: 29-May-2009; LatestRevisionNote: IPC-7351 Footprint Added.; PackageReference: C1206; Publisher: Altium Limited; PackageDescription: Chip Capacitor
D1-D4 D9 D10 = LED2: Typical RED, GREEN, YELLOW, AMBER GaAs LED; Published: 8-Jun-2000; LatestRevisionDate: 17-Jul-2002; LatestRevisionNote: Re-released for DXP Platform.; PackageVersion: Feb-2002; PackageReference: 3.2X1.6X1.1; Publisher: Altium Limited; PackageDescription: SM LED; 2 Flat Leads
D5-D8 = BAT54S
J1 J3 = MD60S
J2 = USB 2.0 Type B Micro
J4 = 1140084168: Memory Card Connector, Microsd, 8 Position, Full Reel; MF: Amphenol ICC; MP: 114-00841-68; Digi-Key_Part_Number: 114-00841-68-1-ND; Package: None; Digi-Key_Purchase_URL: https://www.digikey.com/product-detail/en/amphenol-icc-commercial-products/114-00841-68/114-00841-68-1-ND/2187101?utm_source=snapeda&utm_medium=aggregator&utm_campaign=symbol; SnapEDA_Link: https://www.snapeda.com/parts/114-00841-68/Amphenol%20ICC/view-part/?ref=snap; Value: *
P1 = Header 5: Header, 5-Pin; LatestRevisionDate: 17-Jul-2002; LatestRevisionNote: Re-released for DXP Platform.; Publisher: Altium Limited
P2 = Header 18: Header, 18-Pin; LatestRevisionDate: 17-Jul-2002; LatestRevisionNote: Re-released for DXP Platform.; Publisher: Altium Limited
P3 = Header 4X2: Header, 4-Pin, Dual row; LatestRevisionDate: 17-Jul-2002; LatestRevisionNote: Re-released for DXP Platform.; Publisher: Altium Limited
P4 = Header 5X2: Header, 5-Pin, Dual row; LatestRevisionDate: 17-Jul-2002; LatestRevisionNote: Re-released for DXP Platform.; Publisher: Altium Limited
R1-R61 = Res3: Resistor; Published: 8-Jun-2000; LatestRevisionDate: 29-May-2009; LatestRevisionNote: IPC-7351 Footprint Added.; PackageReference: J1-0603; Publisher: Altium Limited; PackageDescription: Chip Resistor
U4 U11 = M25P16-VMN3PB: 16 Mb (x1) Automotive Serial NOR Flash Memory, 75 MHz, 2.7 to 3.6 V, 8-pin SO8 Narrow (MN), Tube; Part Family: M25P; Manufacturer: Micron; Density: 16Mb; Speed: 75 MHz; Voltage: 2.7V-3.6V; DatasheetVersion: Rev. Y; PackageVersion: Rev 11; PackageReference: MICT-MN-8; PackageDescription: 8-Pin SO Narrow, 3.9 X 4.9 mm, Pitch 1.27 mm; Applications: Automotive; Package: SO8 Narrow; Part Status: Production; RoHS: Yes; Type: Data Storage; Width: x1; Mounting Technology: Surface Mount; PartNumber: M25P16-VMN3PB; ComponentLink1Description: Manufacturer URL; ComponentLink1URL: http://www.micron.com/; ComponentLink2Description: Datasheet; ComponentLink2URL: http://www.micron.com/~/media/Documents/Products/Data%20Sheet/NOR%20Flash/Serial%20NOR/M25P/M25P16.pdf; ComponentLink3Description: Package Specification; ComponentLink3URL: http://www.micron.com/~/media/Documents/Products/Data%20Sheet/NOR%20Flash/Serial%20NOR/M25P/M25P05A.pdf
U5 = FT232RL-Reel: USB UART Asynchronous Serial Data Transfer Chip, 28-pin SSOP, Tape and Reel; Manufacturer: FTDI; DatasheetVersion: ver 2.10, Mar-2012; PackageVersion: Mar-12; PackageReference: SSOP-28; PackageDescription: 28-Pin Small Outline Package 0.65 mm Pitch; PartNumber: FT232RL-Reel; ComponentLink1Description: Manufacturer URL; ComponentLink1URL: http://www.ftdichip.com/; ComponentLink2Description: Datasheet; ComponentLink2URL: http://www.ftdichip.com/Support/Documents/DataSheets/ICs/DS_FT232R.pdf
U6-U9 = BSS138: BSS138 SOT-23
U10 = EP3C25Q240C8: Cyclone III Family FPGA, 148 I/O Pins, 4 PLLs, 240-Pin PQFP, Speed Grade 8, Commercial Grade; Published: 26-Feb-2007; DatasheetVersion: ver2.0, May-2008; PackageVersion: ver15.4, Dec-2008; PackageReference: PQFP240; Publisher: Altium Limited; PackageDescription: 240-Pin Plastic Quad Flat Pack (PQFP240) - Wire Bond; Code_JEDEC: MS-029-GA; ComponentLink1Description: Manufacturer Link; ComponentLink1URL: http://www.altera.com/; ComponentLink2Description: Handbook (7.86MB); ComponentLink2URL: http://www.altera.com/literature/hb/cyc3/cyclone3_handbook.pdf; ComponentLink3Description: Packaging Specification; ComponentLink3URL: http://www.altera.com/literature/ds/dspkg.pdf
U12 = MT48LC4M32B2TG-7: 128Mb PC133 SDR SDRAM, 4Mb x 32, 7ns, 3.3V, 0 to 70 degC, 86-Pin TSOP; Manufacturer: Micron; CL: CL = 3; Clock Rate: 143 MHz; Op. Temp.: 0C to +70C; DatasheetVersion: Rev.Q; PackageVersion: Rev.Q; PackageReference: MICT-TG-86; PackageDescription: 86-Pin Thin Small Outline Package, 10.16 x 22.22 mm, Pitch 0.5 mm; Cycle Time: 7ns; Data Rate: PC133; Density: 128Mb; Depth: 4Mb; RoHS: 5/6; Voltage: 3.3V; Width: x32; Mounting Technology: Surface Mount; PartNumber: MT48LC4M32B2TG-7; ComponentLink1Description: Manufacturer URL; ComponentLink1URL: http://www.micron.com/; ComponentLink2Description: Datasheet; ComponentLink2URL: http://www.micron.com/~/media/Documents/Products/Data%20Sheet/DRAM/128mb_x32_sdram.pdf; ComponentLink3Description: Package Specification; ComponentLink3URL: http://www.micron.com/~/media/Documents/Products/Data%20Sheet/DRAM/128mb_x32_sdram.pdf
Y1 = Abracon XO ASE: SMD CMOS Crystal Oscillator